# Altium schematic sheet Power.SchDoc
size A4; SheetNumber: 2; SheetTotal: 4
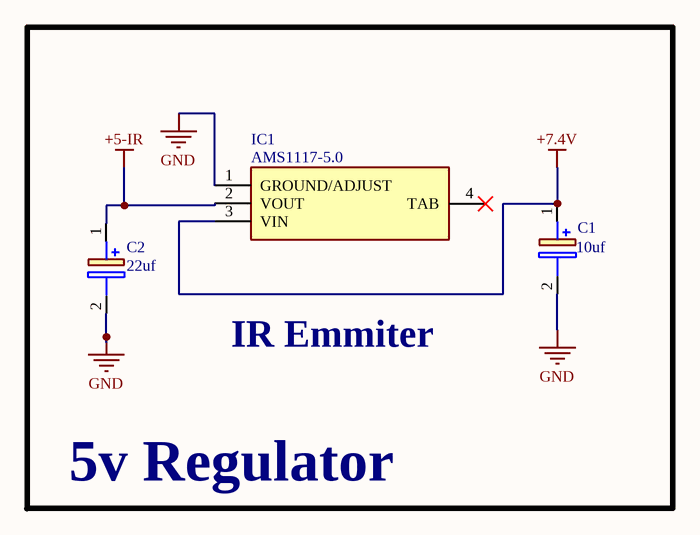
[diagram p0: Power.SchDoc]

## Parts
C1  Capacitance: 10uf  [T491A]  (hidden comment: T491A106K006AT7280)
C2  Capacitance: 22uf  [CAPPM3216X180N]  (hidden comment: F931C226MAAAJ6)
IC1  AMS1117-5.0  [SOT229P700X180-4N]

## Blocks framed on the sheet
5v Regulator: C1 C2 IC1

## Nets
+5-IR: C2.1(+) IC1.2(VOUT)
+7.4V: C1.1(+) IC1.3(VIN)
GND: C1.2(-) C2.2(-) IC1.1(GROUND/ADJUST)

Not connected (* = marked no-connect by the designer): IC1 4(TAB)*

## Notes on the sheet
- IR Emmiter
- Title:
- Auther:
- L.H.H.Maduwantha
- Size:
- A4
- Date:
- File:
- Time:
- Sheet
- Of

## Library data of the parts
C1 = T491A106K006AT7280: Capacitor Polarised; Manufacturer_Name: KEMET; Datasheet Link: https://content.kemet.com/datasheets/KEM_T2005_T491.pdf; Height: 1.8mm; Manufacturer_Part_Number: T491A106K006AT7280; Mouser Part Number: 80-T491A106K0067280; Mouser Price/Stock: https://www.mouser.co.uk/ProductDetail/KEMET/T491A106K006AT7280?qs=EtU2D%2FqTXbN9MxxgrIrCXA%3D%3D; Arrow Part Number: T491A106K006AT7280; Arrow Price/Stock: https://www.arrow.com/en/products/t491a106k006at7280/kemet-corporation?region=nac
C2 = F931C226MAAAJ6: Capacitor Polarised; Manufacturer_Name: Kyocera AVX; Datasheet Link: https://datasheet.datasheetarchive.com/originals/distributors/Datasheets_SAMA/dc9a3b3d744ab3693b5a12837d30b034.pdf; Height: 1.8mm; Manufacturer_Part_Number: F931C226MAAAJ6; Mouser Part Number: 581-F931C226MAAAJ6; Mouser Price/Stock: https://www.mouser.co.uk/ProductDetail/AVX/F931C226MAAAJ6?qs=5aG0NVq1C4wg0PYYXTBb0Q%3D%3D; Arrow Part Number: F931C226MAAAJ6; Arrow Price/Stock: https://www.arrow.com/en/products/f931c226maaaj6/avx
IC1 = AMS1117-5.0: Integrated Circuit; Manufacturer_Name: Advanced Monolithic Systems; Datasheet Link: http://www.advanced-monolithic.com/pdf/ds1117.pdf; Height: 1.8mm; Manufacturer_Part_Number: AMS1117-5.0